# EAGLE design ISO485 (EAGLE 6.2)
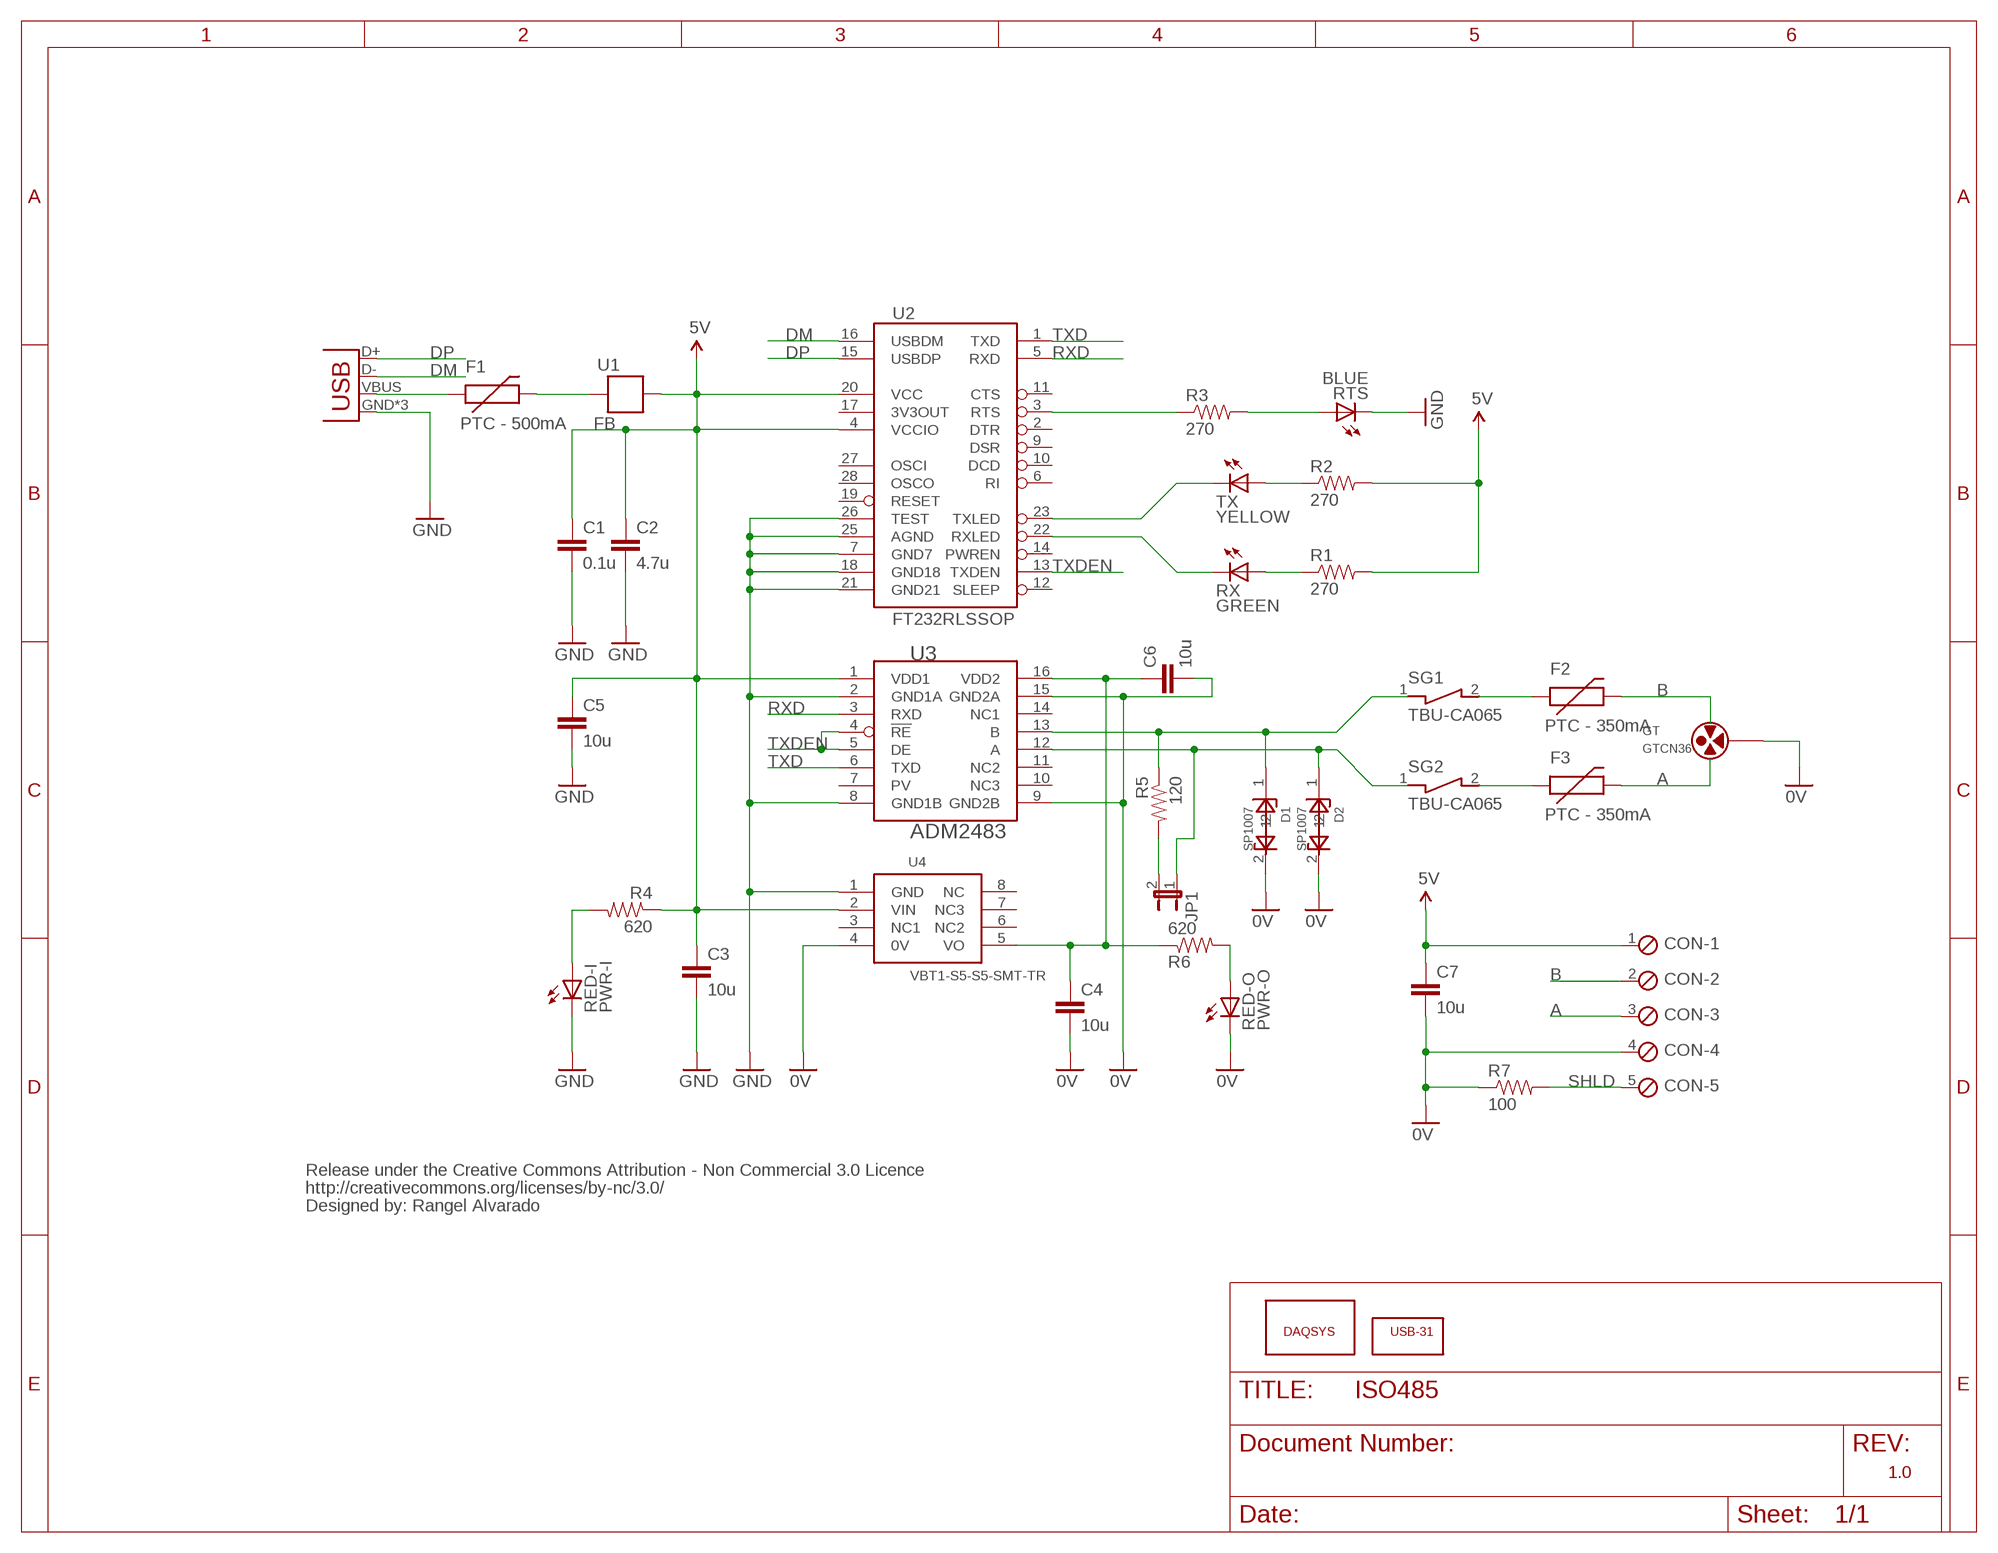
[diagram p0: schematic, sheet 1]

## Parts
C1  0.1u  CAP0603-CAP  [0603-CAP]
C2  4.7u  CAP0603-CAP  [0603-CAP]
C3  10u  CAP0603-CAP  [0603-CAP]
C4  10u  CAP0603-CAP  [0603-CAP]
C5  10u  CAP0603-CAP  [0603-CAP]
C6  10u  CAP0603-CAP  [0603-CAP]
C7  10u  CAP0603-CAP  [0603-CAP]
CON  MPT5  [5POL254]
D1  SP1007  SP1007-01WTG  [0603]
D2  SP1007  SP1007-01WTG  [0603]
F1  PTC - 500mA  PTC0603  [0603]
F2  PTC - 350mA  PTC0603  [0603]
F3  PTC - 350mA  PTC0603  [0603]
GT  GTCN36  GTCN36-401M-R05  [SMT-GDT]
JP1  JUMPER-2PTH  [1X02]
R1  270  RESISTOR0402-RES  [0402-RES]
R2  270  RESISTOR0402-RES  [0402-RES]
R3  270  RESISTOR0402-RES  [0402-RES]
R4  620  RESISTOR0402-RES  [0402-RES]
R5  120  RESISTOR0402-RES  [0402-RES]
R6  620  RESISTOR0402-RES  [0402-RES]
R7  100  RESISTOR1206  [1206]
RED-I  PWR-I  LED1206  [LED-1206]
RED-O  PWR-O  LED1206  [LED-1206]
RTS  BLUE  LED0603  [LED-0603]
RX  GREEN  LED-GREEN0603  [LED-0603]
SG1  TBU-CA065  TBU-CA065-100-WH  [SMD]
SG2  TBU-CA065  TBU-CA065-100-WH  [SMD]
TX  YELLOW  LED-YELLOW0603  [LED-0603]
U1  FB  [0603]
U2  FT232RLSSOP  [SSOP28DB]
U3  ADM2483  [SOIC-16]
U4  VBT1-S5-S5-SMT-TR  [SMD-8]
U$1  CC-BY-NC  [CC-BY-NC]
U$2  DAQSYS  [DAQSYS]
U$3  USB-31  [USB-PCB-RECT]
USB  USB-MICROB  [USB-MICROB]

## Nets
0V: C4.2 C6.2 C7.2 CON.4 D1.2 D2.2 GT.3 R7.1 RED-O.C U3.9(GND2B) U3.15(GND2A) U4.4(0V)
5V: C1.1 C2.1 C3.1 C5.1 C7.1 CON.1 R1.2 R2.2 R4.1 U1.1 U2.4(VCCIO) U2.20(VCC) U3.1(VDD1) U4.2(VIN)
A: CON.3 F3.2 GT.2
B: CON.2 F2.2 GT.1
DM: U2.16(USBDM) USB.D-
DP: U2.15(USBDP) USB.D+
GND: C1.2 C2.2 C3.2 C5.2 RED-I.C RTS.C U2.7(GND7) U2.18(GND18) U2.21(GND21) U2.25(AGND) U2.26(TEST) U3.2(GND1A) U3.8(GND1B) U4.1(GND) USB.GND USB.MT1(GND) USB.MT2(GND)
N$1: F1.1 USB.VBUS
N$2: F1.2 U1.2
N$3: R4.2 RED-I.A
N$4: TX.C U2.23(TXLED)
N$5: RX.C U2.22(RXLED)
N$6: R2.1 TX.A
N$7: R1.1 RX.A
N$8: R3.1 U2.3(RTS)
N$9: R3.2 RTS.A
N$10: D1.1 R5.1 SG1.1 U3.13(B)
N$11: C4.1 C6.1 R6.1 U3.16(VDD2) U4.5(VO)
N$12: D2.1 JP1.1 SG2.1 U3.12(A)
N$13: F2.1 SG1.2
N$14: F3.1 SG2.2
N$15: JP1.2 R5.2
N$16: R6.2 RED-O.A
RXD: U2.5(RXD) U3.3(RXD)
SHLD: CON.5 R7.2
TXD: U2.1(TXD) U3.6(TXD)
TXDEN: U2.13(TXDEN) U3.4(!RE) U3.5(DE)
Unconnected: U2.2(DTR) U2.6(RI) U2.9(DSR) U2.10(DCD) U2.11(CTS) U2.12(SLEEP) U2.14(PWREN) U2.17(3V3OUT) U2.19(RESET) U2.27(OSCI) U2.28(OSCO) U3.7(PV) U3.10(NC3) U3.11(NC2) U3.14(NC1) U4.3(NC1) U4.6(NC2) U4.7(NC3) U4.8(NC)

## Notes on the sheet
- Rangel Alvarado
- 1.0

## Library data of the parts
C1-C7 = SparkFun-Capacitors:CAP: Capacitor Standard 0603 ceramic capacitor, and 0.1" leaded capacitor.
CON = con-phoenix-254:MPT5: PHOENIX CONNECTOR; OC_FARNELL: unknown; OC_NEWARK: unknown
D1 D2 = ISO485:SP1007-01WTG
F1-F3 = SparkFun-PowerIC:PTC: Resettable Fuse PTC Resettable Fuse. Spark Fun Electronics SKU : COM-08357
GT = ISO485:GTCN36-401M-R05
JP1 = SparkFun-Passives:JUMPER-2: Jumper Basic 0.1" spaced jumper. Use with breakaway headers.
R1-R7 = SparkFun-Passives:RESISTOR: Resistor Basic schematic elements and footprints for 0603, 1206, and PTH resistors.
RED-I RED-O RTS = SparkFun-LED:LED: LEDs Standard schematic elements and footprints for 5mm, 3mm, 1206, and 0603 sized LEDs. 5mm - Spark Fun Electronics SKU : COM-00529 (and others)
RX = SparkFun-LED:LED-GREEN: Various green LEDs 0603- DIO-00821 LARGE- DIO-00862 LILYPAD- DIO-09910; PROD_ID: DIO-00821
SG1 SG2 = ISO485:TBU-CA065-100-WH
TX = SparkFun-LED:LED-YELLOW: Yellow SMD LEDs LilyPad 1206- DIO-09909 0603- DIO-09003; PROD_ID: DIO-09003
U1 = SparkFun-Passives:FB
U2 = SparkFun-DigitalIC:FT232RL: USB UART FT232RL 4th Generation USB UART (USB <-> Serial) Controller. Spark Fun Electronics SKU : COM-00650 Production SKU IC-00870; PROD_ID: IC-00870
U3 = ISO485:ADM2483
U4 = ISO485:VBT1-S5-S5-SMT-TR
U$1 = ISO485:CC-BY-NC
U$2 = SEL-FiSH:DAQSYS
U$3 = ISO485:USB-31
USB = SparkFun-Connectors:USB: USB Connectors USB-B-PTH is fully proven SKU : PRT-00139/CONN-08278 USB-miniB is fully proven SKU : PRT-00587 USB-A-PCB is untested. USB-A-H is throughly reviewed, but untested. Spark Fun Electronics SKU : PRT-00437 USB-B-SMT is throughly reviewed, but untested. Needs silkscreen touching up. USB-A-S has not been used/tested USB-MB-H has not been used/tested USB-MICROB has been used. CONN-09505; PROD_ID: CONN-09505

## Board
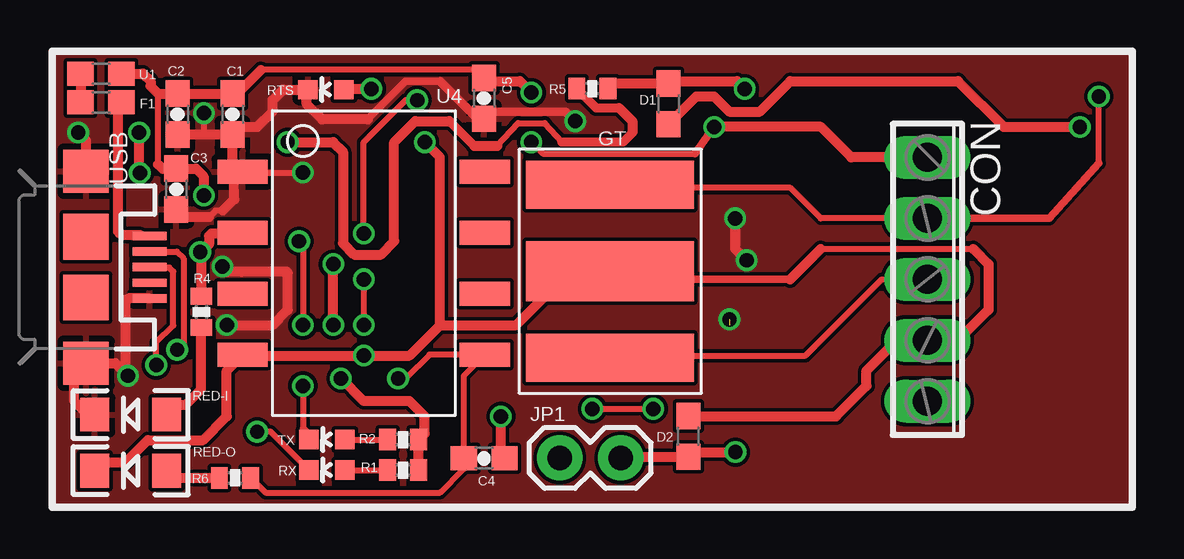
[diagram p1: board, top side]
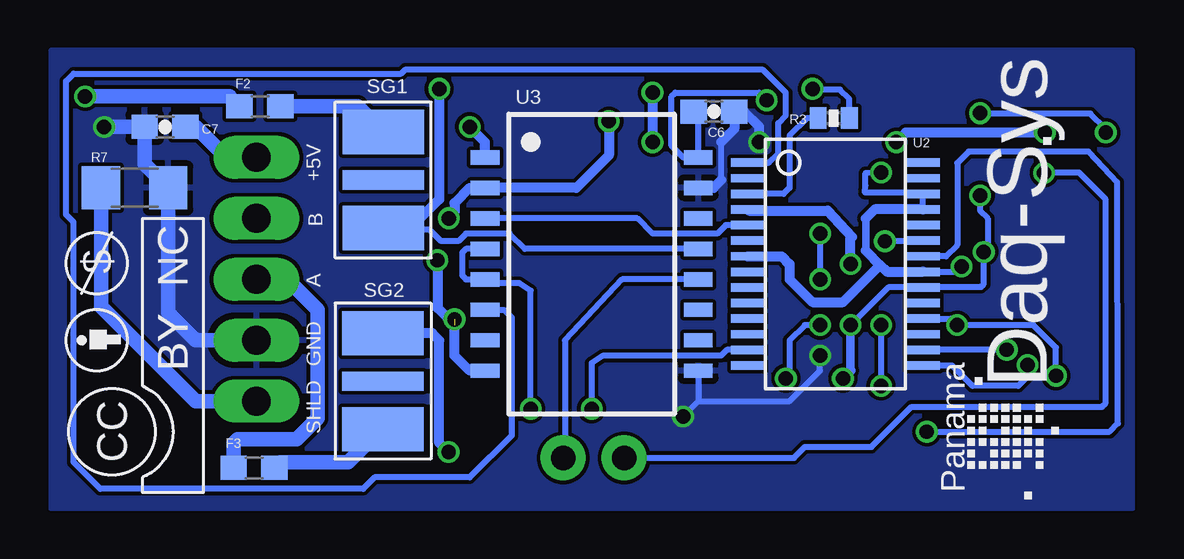
[diagram p2: board, bottom side, seen from below]

No outline drawn. Coordinates in mm, seen from the top.
Copper layers (1*16): Top 0.035mm / dielectric 1.5mm / Bottom 0.035mm
Design rules: minimum track width 6mil, minimum drill 12mil, track to track 6mil, track to pad 6mil, pad to pad 6mil, via to via 6mil, smd to smd 0mil, copper to edge 10mil, drill to drill 10mil, minimum pad ring 10mil, minimum via ring 6mil, stop-mask expansion 2mil, vias tented up to drill 100mil, thermal gap 10mil

### Footprints (pad centres in the part's own frame; a part is rotated, then mirrored left to right if it is on the bottom)
0603-CAP = smd 1.1 x 1: 1 -0.85,0; 2 0.85,0
5POL254 = drill 1.2 long: 1 -5.08,0; 2 -2.54,0; 3 0,0; 4 2.54,0; 5 5.08,0
0603 = smd 1.1 x 1: 1 -0.85,0; 2 0.85,0
SMT-GDT = smd 2 x 7: 1 -3.6,0; 2 3.6,0 | smd 2.5 x 7: 3 0,0
1X02 = drill 1.016 pad 1.88: 1 0,0; 2 2.54,0
0402-RES = smd 0.7 x 0.9: 1 -0.65,0; 2 0.65,0
1206 = smd 1.6 x 1.8: 1 -1.4,0; 2 1.4,0
LED-1206 = smd 1.2 x 1.4: A -1.5,0; C 1.5,0
LED-0603 = smd 0.8 x 0.8: A 0,-0.75; C 0,0.75
SMD = smd 1.85 x 3.4: 1 -2,0; 2 2,0 | smd 0.8 x 3.4: 3 0,0
SSOP28DB = smd 0.348 x 1.397: 1 -4.225,-3.656; 2 -3.575,-3.656; 3 -2.925,-3.656; 4 -2.275,-3.656; 5 -1.625,-3.656; 6 -0.975,-3.656; 7 -0.325,-3.656; 8 0.325,-3.656; 9 0.975,-3.656; 10 1.625,-3.656; 11 2.275,-3.656; 12 2.925,-3.656; 13 3.575,-3.656; 14 4.225,-3.656; 15 4.225,3.656; 16 3.575,3.656; 17 2.925,3.656; 18 2.275,3.656; 19 1.625,3.656; 20 0.975,3.656; 21 0.325,3.656; 22 -0.325,3.656; 23 -0.975,3.656; 24 -1.625,3.656; 25 -2.275,3.656; 26 -2.925,3.656; 27 -3.575,3.656; 28 -4.225,3.656
SOIC-16 = smd 0.6 x 1.2: 1 -4.445,-4.445; 2 -3.175,-4.445; 3 -1.905,-4.445; 4 -0.635,-4.445; 5 0.635,-4.445; 6 1.905,-4.445; 7 3.175,-4.445; 8 4.445,-4.445; 9 4.445,4.445; 10 3.175,4.445; 11 1.905,4.445; 12 0.635,4.445; 13 -0.635,4.445; 14 -1.905,4.445; 15 -3.175,4.445; 16 -4.445,4.445
SMD-8 = smd 1 x 2.1: 1 -2.54,-5.05; 2 0,-5.05; 3 2.54,-5.05; 4 5.08,-5.05; 5 5.08,5.05; 6 2.54,5.05; 7 0,5.05; 8 -2.54,5.05
USB-MICROB = smd 0.35 x 1.4: D+ 0,2.65; D- -0.65,2.65; GND 1.3,2.65; ID 0.65,2.65; VBUS -1.3,2.65 | smd 1.8 x 1.9: MT1 -4,0; MT2 4,0 | smd 1.9 x 1.9: P$1 -1.27,0; P$2 1.27,0

### Placement (x,y rotation side)
C1  -54.37,-3.27 270 top
C2  -56.66,-3.27 270 top
C3  -56.71,-6.4 270 top
C4  -43.88,-17.62 0 top
C5  -43.88,-2.62 270 top
C6  -44.47,-3.17 0 bottom
C7  -21.59,-3.81 180 bottom
CON  -25.4,-10.16 270 top
D1  -36.2,-2.85 270 top
D2  -35.37,-16.7 90 top
F1  -59.85,-2.78 180 top
F2  -25.55,-2.95 180 bottom
F3  -25.3,-18.01 180 bottom
GT  -38.62,-9.82 270 top
JP1  -38.19,-17.6 180 top
R1  -47.26,-18.11 0 top
R2  -47.26,-16.84 0 top
R3  -49.46,-3.44 0 bottom
R4  -55.66,-11.52 270 top
R5  -39.37,-2.21 180 top
R6  -54.26,-18.43 180 top
R7  -20.32,-6.35 180 bottom
RED-I  -58.61,-15.8 180 top
RED-O  -58.61,-18.14 180 top
RTS  -50.48,-2.26 90 top
RX  -50.43,-18.11 90 top
SG1  -30.69,-6.02 90 bottom
SG2  -30.67,-14.41 270 bottom
TX  -50.43,-16.84 90 top
U1  -59.85,-1.59 180 top
U2  -49.53,-9.53 270 bottom
U3  -39.37,-9.53 270 bottom
U4  -48.9,-8.21 270 top
U$1  -20.65,-13.97 90 bottom
U$2  -55.82,-0.91 270 bottom
U$3  -39.37,-10.16 0 top
USB  -60.47,-9.66 270 top

### Tracks (layer width: path | path; a pad name or v marks a point on that pad's centre or on a via)
0V  (via drill 0.6)
  Top 0.254: C4.2 -43.18,-17.47 | D2.2 -35.35,-15.88 | RED-O.C -59.89,-17.78 | -53.95,-13.34 U4.4 | -38.29,-10.16 GT.3 -39.59,-10.79 -41.27,-10.79 | -29.84,-8.89 -23.5,-8.89
  Top 0.305: -38.29,-10.16 -31.11,-10.16
  Top 0.406: -43.18,-17.47 v-43.18,-15.88 | -35.35,-15.88 -29.21,-15.88 -27.94,-14.61 -27.94,-13.97 -26.67,-12.7 CON.4 -24.13,-12.7 -22.86,-11.43 -22.86,-9.53 -23.5,-8.89 | -59.89,-17.78 -58.82,-17.78 -57.9,-16.86 -55.6,-16.86 -54.61,-15.88 -54.61,-13.96 U4.4 | -31.11,-10.16 -29.84,-8.89 | -53.95,-13.34 v-48.9,-13.34 -46.99,-13.34 -45.72,-12.06 | -45.72,-12.06 -42.55,-12.06 -41.27,-10.79 | D1.2 -35.04,-2.54 -34.29,-2.54 -33.66,-3.17 -32.38,-3.17 -31.11,-1.91 -24.13,-1.91 -22.23,-3.81 v-19.05,-3.81 | -45.72,-12.06 -45.72,-5.08 v-46.35,-4.45
  Bottom 0.254: v-48.9,-13.34 -48.9,-13.97 -47.62,-15.24 -43.81,-15.24 | -44.77,-4.45 -44.77,-6.03 | v-43.18,-15.88 -43.81,-15.24 | U3.9 -43.81,-15.24 | -45.72,-3.17 C6.2
  Bottom 0.406: C6.2 -45.32,-3.89 -44.77,-4.45 | -44.77,-6.03 -44.45,-6.35 U3.15 | v-46.35,-4.45 -46.35,-3.81 -45.72,-3.17
  Bottom 0.61: CON.4 -22.86,-12.7 -21.72,-11.56 R7.1 -20.74,-5.37 C7.2 v-19.05,-3.81
  pour Bottom: -61.9,-0.62 -16.85,-0.63 -16.84,-19.68 -61.91,-19.68
5V  (via drill 0.6)
  Top 0.254: U4.2 -53.98,-8.26 | -53.18,-1.43 -44.34,-1.43 C5.1 -43.75,-1.91 | -54.18,-2.42 C1.1 | R2.2 -46.35,-16.59 | -35.08,-4.92 -41.43,-4.92 v-41.91,-4.45 | -57.47,-5.37 -57.47,-2.42 | -56.67,-5.56 C3.1 | -55.58,-6.66 v-55.56,-6.67 | -55.66,-9.07 v-55.72,-9.02
  Top 0.305: v-34.29,-3.81 -35.08,-4.92
  Top 0.406: C1.1 C2.1 -57.47,-2.42 -57.78,-2.11 -57.78,-1.91 -58.1,-1.59 U1.1 | R1.2 R2.2 | CON.1 -28.57,-5.08 -29.84,-3.81 v-34.29,-3.81 | -53.18,-1.43 -54.18,-2.42 | -46.35,-16.59 -46.35,-15.88 -46.99,-15.24 -48.9,-15.24 v-49.85,-14.29 | -43.75,-1.91 -42.39,-1.91 v-41.91,-2.38 | v-50.16,-12.06 v-50.16,-9.53 | -57.47,-5.37 -57.28,-5.56 -56.67,-5.56 | C3.1 -55.89,-5.55 -55.58,-5.87 -55.58,-6.66 | -53.98,-8.26 -55.24,-8.26 -55.35,-8.36 -55.35,-8.7 v-55.72,-9.02 | R4.1 -55.66,-9.07
  Bottom 0.254: -22.86,-3.81 C7.1 | U2.4 -45.93,-7.3 | -50.16,-8.45 -50.22,-8.39 | v-50.16,-12.06 -51.73,-10.5 U2.20 -53.21,-10.48 -55.6,-10.48 -55.72,-10.36 v-55.72,-9.02 | -55.72,-9.07 v-55.72,-9.02 | v-55.56,-6.67 -55.56,-7.3 -55.88,-7.62 -55.88,-8.9 v-55.72,-9.02 | v-55.72,-9.02
  Bottom 0.356: -50.16,-13.97 v-50.16,-12.06
  Bottom 0.406: v-49.85,-14.29 -50.16,-13.97 | -50.22,-8.39 -49.21,-7.3 -45.93,-7.3 | v-41.91,-2.38 v-41.91,-4.45 | U3.1 -34.92,-4.45 v-34.29,-3.81 | v-50.16,-9.53 -50.16,-8.45
  Bottom 0.61: CON.1 -24.13,-5.08 -22.86,-3.81
A
  Top 0.254: GT.2 -38.53,-13.34 -30.48,-13.34 -27.3,-10.16 CON.3
  Bottom 0.61: CON.3 -26.67,-10.16 -27.94,-11.43 -27.94,-15.95 -27.07,-16.83 -24.61,-16.83 -24.45,-16.99 F3.2
B  (via drill 0.6)
  Top 0.254: CON.2 -29.84,-7.62 -31.11,-6.35 -38.1,-6.35 -38.23,-6.22 GT.1 | -18.26,-5.32 v-18.26,-2.54
  Top 0.305: -18.26,-5.32 -20.32,-7.62 CON.2
  Bottom 0.254: F2.2 -24.29,-2.54
  Bottom 0.61: -24.29,-2.54 v-18.26,-2.54
DM  (via drill 0.6)
  Top 0.254: USB.D- -56.69,-9.01 -56.41,-9.29 -56.41,-12.83 v-56.67,-13.1
  Bottom 0.254: v-56.67,-13.1 U2.16
DP  (via drill 0.6)
  Top 0.254: v-57.55,-13.73 -57.55,-12.78 -56.84,-12.09 -56.84,-9.84 -57,-9.68 -57.8,-9.68 USB.D+ -58.15,-9.6
  Bottom 0.254: -57.53,-13.75 v-57.55,-13.73 -57.55,-14.21 -57.15,-14.61 -55.24,-14.61 -54.39,-13.75 U2.15
GND  (via drill 0.6)  (1 unrouted)
  Top 0.254: C1.2 -54.05,-3.81 | U4.1 -53.91,-5.71 v-51.44,-5.71 | U4.1 -54.37,-5.25 | RED-I.C -59.97,-15.88 | -53.98,-5.71 U4.1 | -54.29,-6.02 U4.1 | -44.23,-3.4 -44.23,-3.81 C5.2 -43.59,-3.17 | -51.28,-2.31 RTS.C | USB.MT2 -60.8,-13.18 | -58.1,-10.95 USB.GND | -54.77,-7.3 -55.08,-7.3 -55.35,-7.57 | -56.39,-7.57 C3.2 | -53.96,-9.84 -53.98,-9.86 | v-55.56,-3.24 -55.56,-4.03 -55.46,-4.12 | -58.85,-14.06 v-58.73,-14.18
  Top 0.305: -45.72,-1.91 -47.15,-1.91 -48.74,-3.49
  Top 0.356: -44.23,-3.4 -45.72,-1.91 | -43.59,-3.17 -40.48,-3.17 v-40.08,-3.57
  Top 0.406: C2.2 -55.46,-4.12 C1.2 -54.37,-5.25 | -54.05,-3.81 -53.34,-3.81 -52.7,-3.17 -52.7,-2.7 -52.26,-2.26 RTS.C | -54.77,-7.3 -54.29,-6.83 -54.29,-6.02 | -48.74,-3.49 -50.64,-3.49 -51.28,-2.86 -51.28,-2.31 | v-33.42,-7.62 -33.42,-8.89 v-32.94,-9.37 | RED-I.C -60.48,-15.72 -60.96,-15.24 -60.96,-13.76 USB.MT2 -59.25,-13.65 v-58.73,-14.18 | -55.35,-7.57 -56.39,-7.57 | v-54.61,-12.06 -52.7,-12.06 -52.07,-11.43 -52.07,-9.89 -52.12,-9.84 -53.96,-9.84 | -53.98,-9.86 -54.56,-9.86 v-54.79,-9.63 | USB.MT1 -60.47,-4.38 v-60.8,-4.05 | USB.GND -58.71,-10.96 -58.85,-11.1 -58.85,-14.06
  Bottom 0.254: v-51.44,-5.71 -50.78,-5.73 -50.78,-6.24 -50.76,-6.55 -53.14,-6.55 U2.26 U2.25 | -34.29,-6.35 U3.2 | -53.18,-9.84 U2.21 | v-60.8,-4.05 -60.8,-3.89 -60.17,-3.25 -55.58,-3.25 v-55.56,-3.24 | U2.18 -54.34,-11.8 v-54.61,-12.06 -57.78,-12.06 -58.73,-13.01 v-58.73,-14.18 | -51.67,-9.84 -54.57,-9.84 v-54.79,-9.63
  Bottom 0.305: -50.8,-7.62 -50.8,-8.97
  Bottom 0.406: U3.8 -34.29,-13.97 -33.66,-13.34 -33.66,-12.06 -32.94,-11.35 v-32.94,-9.37 | -34.29,-6.35 -33.66,-6.99 -33.66,-7.38 v-33.42,-7.62 | v-40.08,-3.57 -40.08,-5 -38.73,-6.35 U3.2 | U2.25 -51.17,-7.25 -50.8,-7.62 | -50.8,-8.97 -51.4,-9.56 | -51.4,-9.56 -51.67,-9.84 -53.18,-9.84 | U2.7 -47.3,-9.2 -47.62,-9.53 -47.62,-10.16 -48.58,-11.11 -49.85,-11.11 -51.4,-9.56
  other vias: -33.66,-11.83
  pour Top: -61.9,-0.63 -16.85,-0.64 -16.85,-19.68 -61.9,-19.68
N$1
  Top 0.254: -58.18,-8.33 USB.VBUS | -59.14,-2.92 F1.1
  Top 0.406: -58.18,-8.33 -58.98,-8.33 -59.14,-8.17 -59.14,-2.92
N$2
  Top 0.406: U1.2 F1.2
N$3
  Top 0.254: RED-I.A -56.8,-15.39
  Top 0.406: -56.8,-15.39 -56.33,-15.39 -55.67,-14.74 -55.67,-12.21 R4.2
N$4  (via drill 0.6)
  Top 0.254: v-51.59,-8.57 -51.44,-8.73 v-51.44,-12.06 | v-51.44,-14.61 -51.44,-16.35 -51.18,-16.6 TX.C
  Bottom 0.254: U2.23 -53.16,-8.57 v-51.59,-8.57 | v-51.44,-12.06 v-51.44,-14.61
N$5  (via drill 0.6)
  Top 0.254: RX.C -52.78,-16.51 v-53.34,-16.51
  Bottom 0.254: v-53.34,-16.51 -60.96,-16.51 -61.31,-16.16 -61.28,-6.11 -60.09,-4.84 -55.09,-4.84 -54.61,-5.32 -54.61,-8.73 -54.14,-9.2 U2.22
N$6
  Top 0.254: TX.A R2.1
N$7
  Top 0.254: RX.A R1.1
N$8
  Bottom 0.254: U2.3 -47.38,-6.6 -47.62,-6.35 -47.62,-4.17 -48.34,-3.44 R3.1
N$9  (via drill 0.6)
  Top 0.254: -49.73,-2.22 RTS.A
  Top 0.406: -49.73,-2.22 v-48.58,-2.22
  Bottom 0.254: R3.2 -50.11,-2.64 RTS.A -48.93,-2.26 v-48.58,-2.22
N$10  (via drill 0.6)
  Top 0.254: D1.1 -36.1,-1.91 | R5.1 -38.51,-2
  Top 0.406: -38.51,-2 D1.1 | -36.1,-1.91 -33.34,-1.91 v-33.02,-2.22
  Bottom 0.254: U3.13 -36.59,-8.89 -35.96,-8.26 -34.13,-8.26 -33.81,-8.57 -33.1,-8.57 -32.62,-8.1 -31.75,-8.1 -30.76,-8.1 SG1.1
  Bottom 0.406: v-33.02,-2.22 -33.02,-6.83 -31.75,-8.1
N$11  (via drill 0.6)
  Top 0.254: R6.1 -53,-19.05 -45.72,-19.05 -44.73,-18.06 C4.1 -44.73,-14.18 U4.5 -46.16,-13.29 -47.15,-14.29 v-47.47,-14.29 | v-48.9,-8.26 -48.9,-4.45 -47.15,-2.7 v-46.67,-2.7 | v-48.9,-10.16 v-48.9,-12.06
  Bottom 0.254: C6.1 -43.81,-3.37 U3.16 -43.18,-5.08 -42.7,-4.6 -42.7,-2.54 -42.86,-2.38 -46.35,-2.38 v-46.67,-2.7 | v-48.9,-8.26 v-48.9,-10.16 | v-48.9,-12.06 -48.26,-12.06 -47.62,-12.7 -47.62,-14.13 v-47.47,-14.29
N$12  (via drill 0.6)
  Top 0.254: JP1.1 -38.14,-17.55 | D2.1 -35.17,-17.36
  Top 0.406: -38.14,-17.55 D2.1 | -35.17,-17.36 v-33.41,-17.36
  Bottom 0.254: U3.12 -40.64,-10.16 -38.26,-12.7 -38.26,-17.52 JP1.1
  Bottom 0.406: v-33.41,-17.36 -33.02,-16.97 -33.02,-12.7 -32.73,-12.41 SG2.1
N$13
  Bottom 0.61: SG1.2 -29.61,-2.95 F2.1
N$14
  Bottom 0.254: SG2.2 -30.57,-16.51 -30.48,-16.51 | -26.44,-18.01 F3.1 -26.38,-17.78
  Bottom 0.61: -30.48,-16.51 -29.21,-17.78 -26.38,-17.78
N$15  (via drill 0.6)
  Top 0.254: -42.47,-3.65 -41.35,-3.65 | R5.2
  Top 0.279: -43.34,-4.6 -42.47,-3.65 | -41.35,-3.65 -40.64,-4.45
  Top 0.356: -45.32,-3.57 -44.29,-4.6
  Top 0.381: -37.7,-4.05 -38.1,-4.45 -40.64,-4.45 | R5.2 -39.21,-3.02 -38.26,-3.02
  Top 0.406: v-52.07,-4.45 -50.16,-4.45 -49.77,-4.84 -49.77,-8.65 -49.29,-9.13 -48.18,-9.13 -47.62,-8.57 -47.62,-4.45 -46.75,-3.57 -45.32,-3.57 | -44.29,-4.6 -43.34,-4.6 | -38.26,-3.02 -37.7,-3.57 -37.7,-4.05 | v-58.23,-5.73 -58.26,-5.73 v-58.26,-4.05
  Bottom 0.254: JP1.2 -47.8,-17.6 -48.26,-17.14 -51.04,-17.14 -52.7,-15.48 -60.64,-15.48 -60.8,-15.32 -60.8,-6.83 -59.69,-5.71 -58.55,-5.71 v-58.23,-5.73
  Bottom 0.406: v-58.26,-4.05 -52.47,-4.05 v-52.07,-4.45
N$16
  Top 0.254: RED-O.A -56.7,-18.43
  Top 0.406: -56.7,-18.43 R6.2
RXD
  Bottom 0.254: U2.5 -44.96,-7.9 -44.61,-8.26 -41.91,-8.26 -41.27,-7.62 U3.3
SHLD
  Bottom 0.61: CON.5 -22.86,-15.24 -18.92,-11.3 R7.2
TXD
  Bottom 0.254: U3.6 -35.72,-11.43 -36.04,-11.75 -36.04,-16.67 -34.29,-18.41 -30.32,-18.41 -29.84,-18.89 -18.89,-18.89 -17.78,-17.78 -17.78,-7.78 -17.46,-7.46 -17.46,-1.91 -17.78,-1.59 -31.43,-1.59 -31.59,-1.43 -46.51,-1.43 -47.47,-2.38 -47.47,-3.33 -47.15,-3.65 -47.15,-4.92 -46.77,-5.3 U2.1
TXDEN  (via drill 0.6)
  Top 0.254: v-39.37,-15.56 v-36.83,-15.56
  Bottom 0.254: U3.4 -34.13,-8.89 -33.97,-9.05 -33.97,-10 -34.13,-10.16 U3.5 -35.08,-10.32 -36.35,-10.32 -36.83,-10.64 v-36.83,-15.56 | U2.13 -45,-13.1 -44.77,-13.34 -39.85,-13.34 -39.37,-13.65 v-39.37,-15.56

### Text on the board
bPlace: +5V | B | A | GND | SHLD